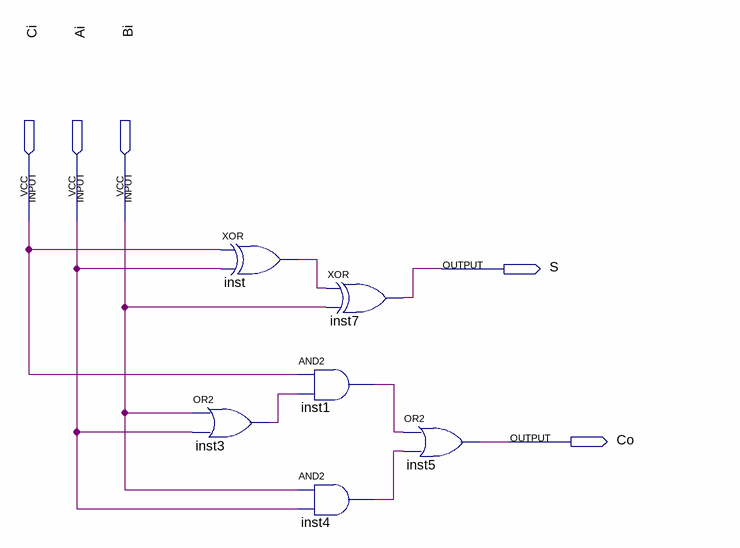
[diagram p0: schematic sheet]
// Quartus schematic full_adder.bdf as structural Verilog: 6 symbols, 5 pins
module full_adder (
  input  Ci,
  input  Ai,
  input  Bi,
  output S,
  output Co
);

  wire inst1_out, inst3_out, inst4_out, inst_out;

  xor inst (inst_out, Ci, Ai);
  or inst3 (inst3_out, Bi, Ai);
  and inst1 (inst1_out, Ci, inst3_out);
  and inst4 (inst4_out, Bi, Ai);
  xor inst7 (S, inst_out, Bi);
  or inst5 (Co, inst1_out, inst4_out);
endmodule
